# Altium schematic sheet IMU_SCH.SchDoc
size A; SheetNumber: 7; SheetTotal: 8
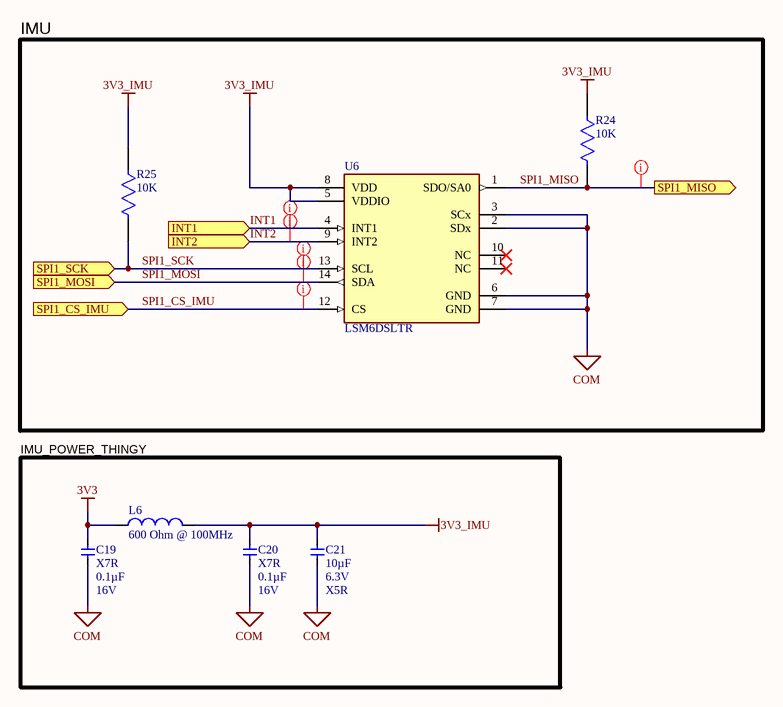
[diagram p0: IMU_SCH.SchDoc]

## Parts
C19  Temperature Coefficient: X7R  Capacitance: 0.1µF  Voltage - Rated: 16V  [C0603]  (hidden comment: GRM188R71C104KA01D)
C20  Temperature Coefficient: X7R  Capacitance: 0.1µF  Voltage - Rated: 16V  [C0603]  (hidden comment: GRM188R71C104KA01D)
C21  Capacitance: 10µF  Voltage - Rated: 6.3V  Temperature Coefficient: X5R  [C0603]  (hidden comment: GRM188R60J106ME47D)
L6  Impedance @ Frequency: 600 Ohm @ 100MHz  [L0603]  (hidden comment: MMZ1608B601C)
R24  10K  [FP-ERJ3G-IPC_C]
R25  10K  [FP-ERJ3G-IPC_C]
U6  LSM6DSLTR  [FP-LGA-14L-DM00249496-MFG]

## Blocks framed on the sheet
IMU: R24 R25 U6
IMU_POWER_THINGY: C19-C21 L6

## Ports
INT1 (in), INT2 (in), SPI1_CS_IMU (in), SPI1_MISO (out), SPI1_MOSI (in), SPI1_SCK (in)

## Nets
3V3: C19.2 L6.1
3V3_IMU: C20.2 C21.2 L6.2 R24.1 R25.1 U6.5(VDDIO) U6.8(VDD)
COM: C19.1 C20.1 C21.1 U6.2(SDx) U6.3(SCx) U6.6(GND) U6.7(GND)
INT1: U6.4(INT1) ; port INT1
INT2: U6.9(INT2) ; port INT2
SPI1_CS_IMU: U6.12(CS) ; port SPI1_CS_IMU
SPI1_MISO: R24.2 U6.1(SDO/SA0) ; port SPI1_MISO
SPI1_MOSI: U6.14(SDA) ; port SPI1_MOSI
SPI1_SCK: R25.2 U6.13(SCL) ; port SPI1_SCK

Not connected (* = marked no-connect by the designer): U6 10(NC)* 11(NC)*

## Layout directives
net class 50_Ohm: INT1, INT2, SPI1_CS_IMU, SPI1_MISO, SPI1_MOSI, SPI1_SCK

## Library data of the parts
C19 C20 = GRM188R71C104KA01D: CAP CER 0.1UF 16V 10% X7R 0603; ComponentLink1Description: Datasheet; ComponentLink1URL: http://search.murata.co.jp/Ceramy/image/img/A01X/G101/ENG/GRM188R71C104KA01-01.pdf; ComponentLink2URL: http://media.digikey.com/photos/Murata%20Photos/0603%20Murata%20MLCC%20Caps.jpg; ComponentLink2Description: Photo; Pricing 1: 1=0.13 (USD); Tolerance: ±10%; Operating Temperature: -55°C ~ 125°C; Applications: General Purpose; Supplier 1: Digi-Key; Supplier Part Number 1: 490-1532-1-ND
C21 = GRM188R60J106ME47D: CAP CER 10UF 6.3V X5R 0603; Manufacturer: Murata Electronics North America; Tolerance: ±20%; Supplier 1: Digi-Key; Supplier Part Number 1: 490-3896-1-ND; Manufacturer Part Number: GRM188R60J106ME47D; RoHS: RoHS Compliant; Category: Capacitors; Stock 1: 3077943; Pricing 1: 1=0.28, 10=0.186, 50=0.1124, 100=0.0944, 250=0.0764, 500=0.0674, 1000=0.0573 (CAD); Packaging: Cut Tape (CT); Mounting Type: Surface Mount, MLCC; Operating Temperature: -55°C ~ 85°C; Applications: General Purpose; Ratings: -; Package / Case: 0603 (1608 Metric); Size / Dimension: 0.063" L x 0.031" W (1.60mm x 0.80mm); Height - Seated (Max): -; Thickness (Max): 0.035" (0.90mm); Lead Spacing: -; Features: -; Lead Style: -; ComponentLink1URL: http://www.murata.com/~/media/webrenewal/support/library/catalog/products/capacitor/mlcc/c02e.ashx; ComponentLink1Description: http://www.murata.com/~/media/webrenewal/support/library/catalog/products/capacitor/mlcc/c02e.ashx
L6 = MMZ1608B601C: FERRITE CHIP 600 OHM 500MA 0603; DC Resistance (DCR): 400 mOhm Max; Filter Type: Differential Mode - Single; Current Rating: 500mA; ComponentLink1URL: http://product.tdk.com/en/catalog/datasheets/beads_commercial_signal_mmz_en.pdf; ComponentLink1Description: datasheet; ComponentLink2URL: http://media.digikey.com/Renders/TDK%20Renders/MMZ1608xxxxxTAH0.jpg; ComponentLink2Description: photo; Supplier 1: Digi-Key; Supplier Part Number 1: 445-2166-1-ND
R24 R25 = CMP-2000-00704-2: RES SMD 10K OHM 5% 1/10W 0603; Temperature Coefficient: 200ppm/°C; Max Power Dissipation: 100mW; Resistance: 10kR; Voltage Rating (DC): 50V; Voltage Rating: 75V; Resistor Type: Thick Film; Tolerance: 5%; Military Standard: Not; Package Quantity: 1; Max Operating Temperature: 155°C; Mount: Surface Mount; Technology: THICK FILM; Case/Package: 0603; Construction: Rectangular; Depth: 0.8mm; Case Code (Imperial): 0603; Weight: 7.1E-05oz; Features: Automotive AEC-Q200; Packaging: Tape and Reel; Width: 0.8mm; Length: 1.6mm; Termination: SMD/SMT; Power Rating: 100mW; Lead Free: Lead Free; Number of Terminations: 2; Height: 0.45mm; RoHS Compliant: Yes; Min Operating Temperature: -55°C; Contact Plating: Tin; REACH SVHC: No SVHC; Resistance Tolerance: 5%; Series: ERJ; Working Voltage: 75V; Case Code (Metric): 1608
U6 = CMP-2000-07467-2: IMU ACCEL/GYRO I2C/SPI 14LGA; Manufacturer: STMicroelectronics; Resolution: 16bits; Max Supply Voltage: 3.6V; Sensor Type: Temperature,Accelerometer,Gyroscope; Sensor Output: I2C,SPI; Gyro Range: 125/250/500/1000/2000°/s; Accel Range: 2/4/8/16g; Operating Supply Current: 0.29-0.65mA; Min Supply Voltage: 1.62V; Package: LGA-14L-DM00249496; Temperature Range High: +85°C; Automotive: No; Footprint Url: https://www.st.com/resource/en/technical_note/cd00134799.pdf; Height: 0.86mm; Device Class L1: Sensors; Octopart: https://octopart.com/lsm6dsltr-stmicroelectronics-66358193; Device Class L2: Motion Sensors; Lead Free: Yes; Category: IC; Device Class L3: Inertial Measurement Units (IMUs); ComponentLink2Description: Datasheet; RoHS: TRUE; ComponentLink2URL: https://www.st.com/resource/en/datasheet/lsm6dsl.pdf; Temperature Range Low: -40°C; Manufacturer Part Number: LSM6DSLTR; Mouser Description: iNEMO inertial module: always-on 3D accelerometer and 3D gyroscope; Digikey Description: IMU ACCEL/GYRO I2C/SPI 14LGA; Temperature: -40°C to +85°C